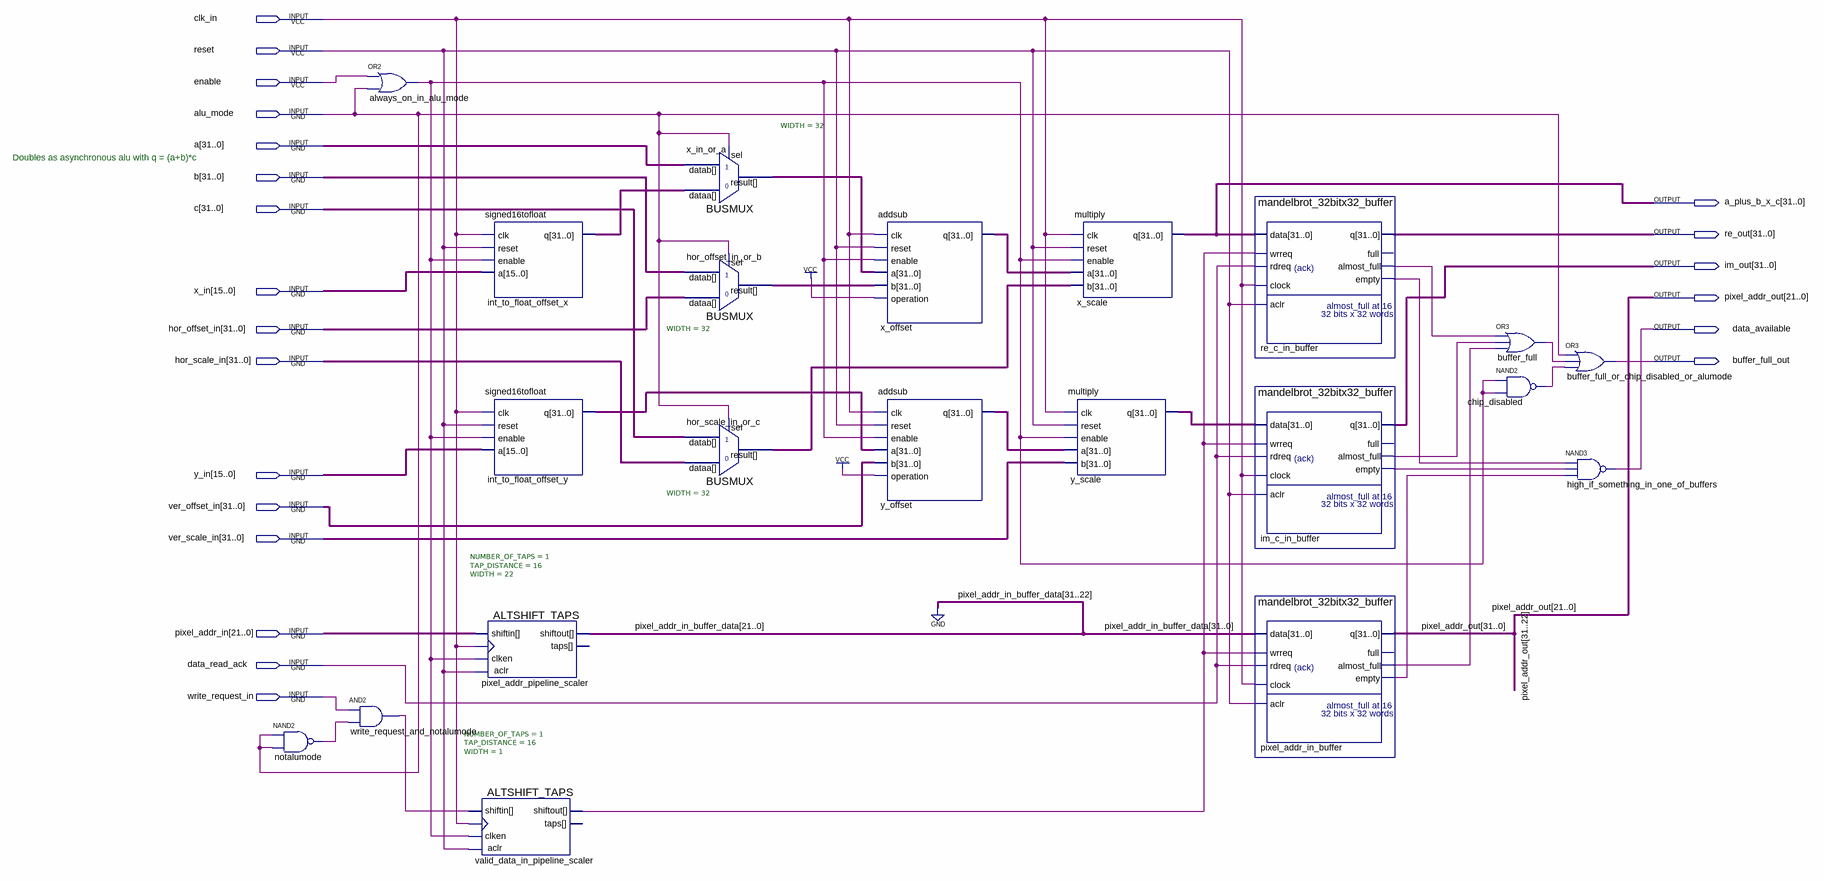
[diagram p0: schematic sheet]
// Quartus schematic pannerscaler.bdf as structural Verilog: 21 symbols, 22 pins
module pannerscaler (
  input  clk_in,
  input  reset,
  input  enable,
  input  alu_mode,
  input  [31:0] a,
  input  [31:0] b,
  input  [31:0] c,
  input  [15:0] x_in,
  input  [31:0] hor_offset_in,
  input  [31:0] hor_scale_in,
  input  [15:0] y_in,
  input  [31:0] ver_offset_in,
  input  [31:0] ver_scale_in,
  input  [21:0] pixel_addr_in,
  input  data_read_ack,
  input  write_request_in,
  output [31:0] a_plus_b_x_c,
  output [31:0] re_out,
  output [31:0] im_out,
  output [31:0] pixel_addr_out,
  output data_available,
  output buffer_full_out
);

  wire always_on_in_alu_mode_out, buffer_full_out_2, chip_disabled_out, im_c_in_buffer_almost_full,
       im_c_in_buffer_empty, notalumode_out, pixel_addr_in_buffer_almost_full, pixel_addr_in_buffer_empty,
       re_c_in_buffer_almost_full, re_c_in_buffer_empty, valid_data_in_pipeline_scaler_shiftout,
       write_request_and_notalumode_out;
  wire [21:0] pixel_addr_in_buffer_data;
  wire [31:0] hor_offset_in_or_b_result, hor_scale_in_or_c_result, int_to_float_offset_x_q,
       int_to_float_offset_y_q, x_in_or_a_result, x_offset_q, y_offset_q, y_scale_q;

  nand notalumode (notalumode_out, alu_mode, alu_mode);
  and write_request_and_notalumode (write_request_and_notalumode_out, write_request_in, notalumode_out);
  or always_on_in_alu_mode (always_on_in_alu_mode_out, enable, alu_mode);
  signed16tofloat int_to_float_offset_x (
    .clk(clk_in), .reset(reset), .enable(always_on_in_alu_mode_out), .a(x_in), .q(int_to_float_offset_x_q));
  signed16tofloat int_to_float_offset_y (
    .clk(clk_in), .reset(reset), .enable(always_on_in_alu_mode_out), .a(y_in), .q(int_to_float_offset_y_q));
  ALTSHIFT_TAPS #(.NUMBER_OF_TAPS(1), .TAP_DISTANCE(16), .WIDTH(22)) pixel_addr_pipeline_scaler (
    .shiftin(pixel_addr_in), .clken(always_on_in_alu_mode_out), .clock(clk_in), .aclr(reset),
    .shiftout(pixel_addr_in_buffer_data));  // open: taps
  ALTSHIFT_TAPS #(.NUMBER_OF_TAPS(1), .TAP_DISTANCE(16), .WIDTH(1)) valid_data_in_pipeline_scaler (
    .shiftin(write_request_and_notalumode_out), .clken(always_on_in_alu_mode_out), .clock(clk_in),
    .aclr(reset), .shiftout(valid_data_in_pipeline_scaler_shiftout));  // open: taps
  BUSMUX #(.WIDTH(32)) x_in_or_a (
    .datab(a), .sel(alu_mode), .dataa(int_to_float_offset_x_q), .result(x_in_or_a_result));
  BUSMUX #(.WIDTH(32)) hor_offset_in_or_b (
    .datab(b), .sel(alu_mode), .dataa(hor_offset_in), .result(hor_offset_in_or_b_result));
  BUSMUX #(.WIDTH(32)) hor_scale_in_or_c (
    .datab(c), .sel(alu_mode), .dataa(hor_scale_in), .result(hor_scale_in_or_c_result));
  addsub x_offset (
    .clk(clk_in), .reset(reset), .enable(always_on_in_alu_mode_out), .a(x_in_or_a_result),
    .b(hor_offset_in_or_b_result), .operation(1'b1), .q(x_offset_q));
  addsub y_offset (
    .clk(clk_in), .reset(reset), .enable(always_on_in_alu_mode_out), .a(int_to_float_offset_y_q),
    .b(ver_offset_in), .operation(1'b1), .q(y_offset_q));
  multiply x_scale (
    .clk(clk_in), .reset(reset), .enable(always_on_in_alu_mode_out), .a(x_offset_q),
    .b(hor_scale_in_or_c_result), .q(a_plus_b_x_c));
  multiply y_scale (
    .clk(clk_in), .reset(reset), .enable(always_on_in_alu_mode_out), .a(y_offset_q), .b(ver_scale_in),
    .q(y_scale_q));
  mandelbrot_32bitx32_buffer re_c_in_buffer (
    .data(a_plus_b_x_c), .wrreq(valid_data_in_pipeline_scaler_shiftout), .rdreq(data_read_ack),
    .clock(clk_in), .aclr(reset), .q(re_out), .almost_full(re_c_in_buffer_almost_full),
    .empty(re_c_in_buffer_empty));  // open: full
  mandelbrot_32bitx32_buffer im_c_in_buffer (
    .data(y_scale_q), .wrreq(valid_data_in_pipeline_scaler_shiftout), .rdreq(data_read_ack), .clock(clk_in),
    .aclr(reset), .q(im_out), .almost_full(im_c_in_buffer_almost_full), .empty(im_c_in_buffer_empty));  // open: full
  mandelbrot_32bitx32_buffer pixel_addr_in_buffer (
    .data({{10{1'b0}}, pixel_addr_in_buffer_data}), .wrreq(valid_data_in_pipeline_scaler_shiftout),
    .rdreq(data_read_ack), .clock(clk_in), .aclr(reset), .q(pixel_addr_out),
    .almost_full(pixel_addr_in_buffer_almost_full), .empty(pixel_addr_in_buffer_empty));  // open: full
  or buffer_full (buffer_full_out_2, re_c_in_buffer_almost_full, im_c_in_buffer_almost_full, pixel_addr_in_buffer_almost_full);
  nand chip_disabled (chip_disabled_out, always_on_in_alu_mode_out, always_on_in_alu_mode_out);
  or buffer_full_or_chip_disabled_or_alumode (buffer_full_out, alu_mode, buffer_full_out_2, chip_disabled_out);
  nand high_if_something_in_one_of_buffers (data_available, re_c_in_buffer_empty, im_c_in_buffer_empty, pixel_addr_in_buffer_empty);

  // Notes on the sheet:
  //   Doubles as asynchronous alu with q = (a+b)*c
endmodule
